# EasyEDA Pro project ProPrj_ETHlink8DAC_V1.0.epro, board ETHlink8xDAC_PCB
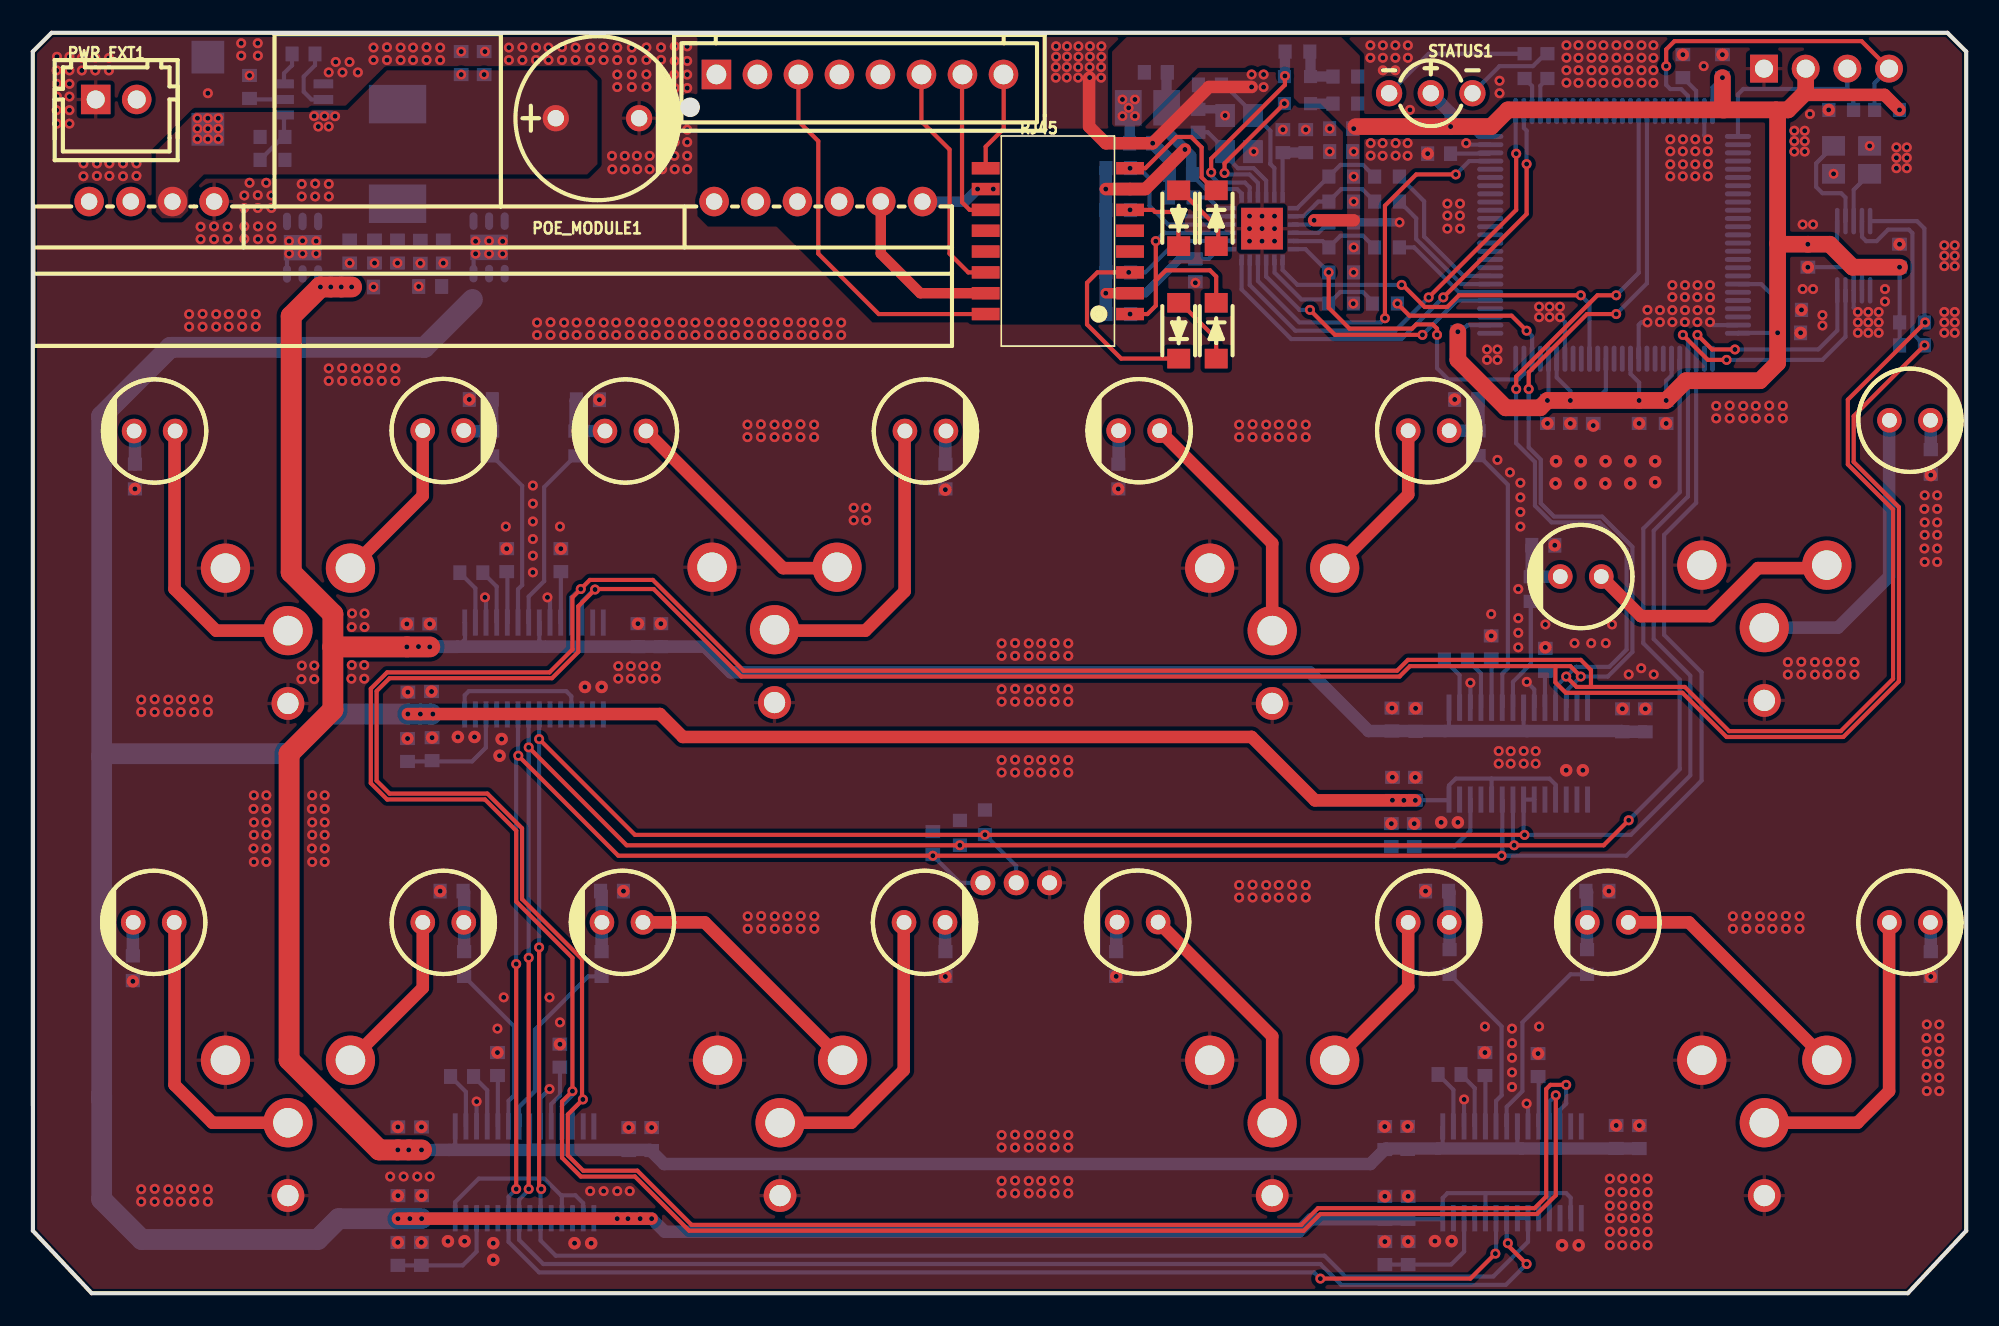
[diagram p8: board, top side]
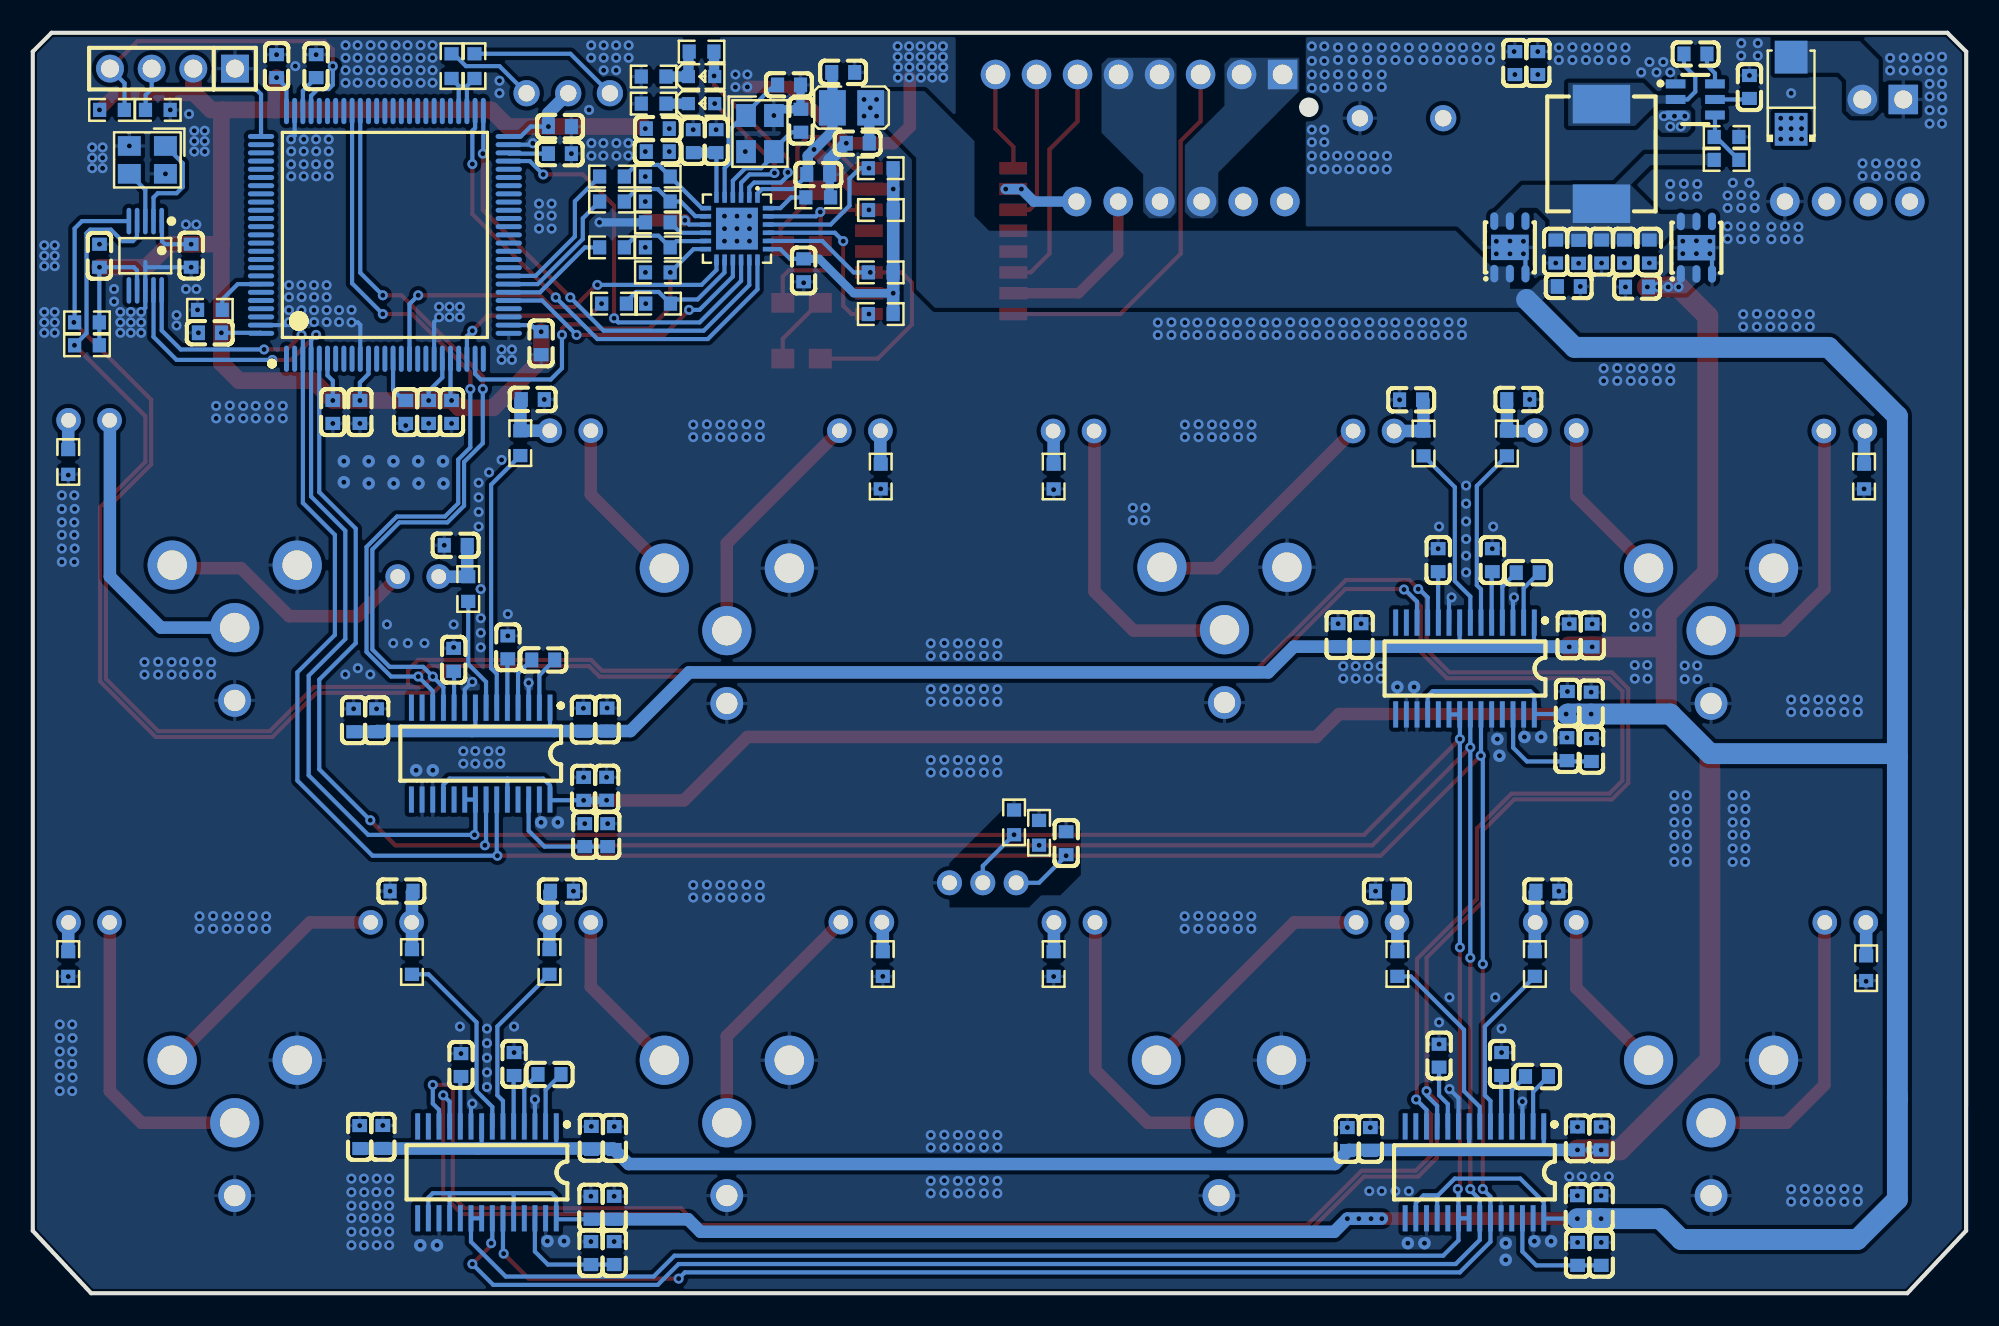
[diagram p9: board, bottom side, seen from below]

Outline 117.86 x 76.84 mm; copper layers: Top Layer, Bottom Layer. Coordinates in mm from the lower left corner of the outline.
Outline path: 0,75.69 1.15,76.84 116.72,76.84 117.86,75.69 117.86,3.8 114.3,0 3.59,0 0,3.81 0,75.69
Stack: Top Layer 0.035mm / Dielectric1 1.51mm FR4 er 4.5 / Bottom Layer 0.035mm

## Design rules (mm)
template: JLCPCB Capability(Two Layers Board)
spacing copperThickness1oz (default): track to track 0.102, other pairs 0.152 to 0.3
spacing copperThickness2oz: track to track 0.203, other pairs 0.152 to 0.3
track width copperThickness1oz (default): min 0.127, default 0.254, max 2.54
track width copperThickness2oz: min 0.203, default 0.254, max 2.54
differential pair differentialPair (default): width min 0.127, default 0.254, max 2.54; gap min 0.152, default 0.152
via viaSize (default): diameter min 0.5, default 0.61, max 10; hole min 0.3, default 0.305, max 6.3

## Placement (name value [footprint] x y rotation side)
C116  10uF  [C0603]  38.29 40.11 270 bottom
C117  100nF  [C0603]  36.89 40.11 270 bottom
C118  860020773013  [CAP-TH_BD6.3-P2.50-D0.5-FD]  7.43 52.56 180 top
C119  10uF  [C0603]  82.85 34.97 270 bottom
C120  860020773013  [CAP-TH_BD6.3-P2.50-D0.5-FD]  25.02 52.59 0 top
C121  860020773013  [CAP-TH_BD6.3-P2.50-D0.5-FD]  36.13 52.56 180 top
C122  2.2nF  [C0603]  33.84 54.47 0 bottom
C123  860020773013  [CAP-TH_BD6.3-P2.50-D0.5-FD]  54.42 52.56 0 top
C124  100nF  [C0603]  84.3 34.95 270 bottom
C125  860020773013  [CAP-TH_BD6.3-P2.50-D0.5-FD]  114.43 53.21 0 top
C126  100nF  [C0603]  24.31 35.98 270 bottom
C127  10uF  [C0603]  22.86 35.94 270 bottom
C128  100nF  [C0603]  22.8 40.1 270 bottom
C129  10uF  [C0603]  24.2 40.1 270 bottom
C130  2.2uF  [C0603]  28.89 44.69 270 bottom
C131  860020773013  [CAP-TH_BD6.3-P2.50-D0.5-FD]  94.36 43.69 180 top
C132  2.2nF  [C0603]  27.31 54.48 0 bottom
C133  10uF  [C0603]  32.19 44.69 270 bottom
C134  2.2uF  [C0603]  26.73 43.92 0 bottom
C135  100nF  [C0603]  24.34 33.17 270 bottom
C136  10uF  [C0603]  22.84 33.11 270 bottom
C137  860020773013  [CAP-TH_BD6.3-P2.50-D0.5-FD]  85.09 52.58 0 top
C138  2.2nF  [C0603]  87.38 54.48 180 bottom
C139  860020773013  [CAP-TH_BD6.3-P2.50-D0.5-FD]  67.44 52.58 180 top
C140  100nF  [C0603]  84.28 30.74 270 bottom
C141  10uF  [C0603]  82.88 30.75 270 bottom
C142  100nF  [C0603]  98.3 34.93 270 bottom
C143  10uF  [C0603]  96.91 34.93 270 bottom
C144  2.2uF  [C0603]  88.9 39.37 270 bottom
C145  2.2nF  [C0603]  92.08 45.59 180 bottom
C146  10uF  [C0603]  92.21 38.61 270 bottom
C147  2.2uF  [C0603]  86.75 38.61 0 bottom
C148  100nF  [C0603]  84.21 27.92 270 bottom
C149  10uF  [C0603]  82.82 27.92 270 bottom
C150  10uF  [C0603]  22.25 9.44 270 bottom
C151  100nF  [C0603]  23.7 9.44 270 bottom
C152  860020773013  [CAP-TH_BD6.3-P2.50-D0.5-FD]  54.36 22.61 0 top
C153  860020773013  [CAP-TH_BD6.3-P2.50-D0.5-FD]  35.95 22.61 180 top
C154  860020773013  [CAP-TH_BD6.3-P2.50-D0.5-FD]  25.02 22.61 0 top
C155  2.2nF  [C0603]  25.53 24.51 180 bottom
C156  860020773013  [CAP-TH_BD6.3-P2.50-D0.5-FD]  7.37 22.61 180 top
C157  100nF  [C0603]  23.7 5.24 270 bottom
C158  10uF  [C0603]  22.26 5.24 270 bottom
C159  100nF  [C0603]  36.33 9.4 270 bottom
C160  10uF  [C0603]  37.72 9.4 270 bottom
C161  2.2uF  [C0603]  28.33 13.97 270 bottom
C162  2.2nF  [C0603]  35.31 24.51 180 bottom
C163  10uF  [C0603]  32.14 14.48 270 bottom
C164  2.2uF  [C0603]  26.17 13.21 0 bottom
C165  100nF  [C0603]  23.69 2.4 270 bottom
C166  10uF  [C0603]  22.25 2.4 270 bottom
C167  10uF  [C0603]  83.81 9.47 270 bottom
C168  100nF  [C0603]  82.41 9.46 270 bottom
C169  860020773013  [CAP-TH_BD6.3-P2.50-D0.5-FD]  114.43 22.61 0 top
C170  860020773013  [CAP-TH_BD6.3-P2.50-D0.5-FD]  96.02 22.61 180 top
C171  860020773013  [CAP-TH_BD6.3-P2.50-D0.5-FD]  85.09 22.61 0 top
C172  2.2nF  [C0603]  85.6 24.51 180 bottom
C173  860020773013  [CAP-TH_BD6.3-P2.50-D0.5-FD]  67.35 22.62 180 top
C174  100nF  [C0603]  82.42 5.21 270 bottom
C175  10uF  [C0603]  83.84 5.21 270 bottom
C176  100nF  [C0603]  96.52 9.53 270 bottom
C177  10uF  [C0603]  97.93 9.52 270 bottom
C178  2.2uF  [C0603]  88.52 13.97 270 bottom
C179  2.2nF  [C0603]  95.38 24.51 180 bottom
C180  10uF  [C0603]  91.76 13.91 270 bottom
C181  2.2uF  [C0603]  86.36 13.34 0 bottom
C182  100nF  [C0603]  83.84 2.45 270 bottom
C183  10uF  [C0603]  82.42 2.45 270 bottom
C184  10uF  [C0603]  113.8 63.25 90 bottom
C185  10uF  [C0603]  108.21 63.25 270 bottom
C192  100nF  [C0603]  26.12 74.99 270 bottom
C193  100nF  [C0603]  16.5 75.55 0 bottom
C194  10uF  [C0603]  25.02 63.5 90 bottom
C195  10uF  [C0603]  20.83 63.5 90 bottom
C196  10uF  [C0603]  22.23 63.5 90 bottom
C197  10uF  [C0603]  19.32 63.5 90 bottom
C198  1000uF  [CAP-TH_BD10.0-P5.00-D1.0-FD]  34.42 71.63 0 top
C201  100nF  [C0603]  13.21 73.53 90 bottom
C202  10uF  [C0603]  24.22 61.37 180 bottom
C203  10uF  [C0603]  23.63 63.48 270 bottom
C204  10uF  [C0603]  20.07 61.34 0 bottom
C210  1uF  [C0603]  27.51 74.99 270 bottom
C214  100nF  [C0603]  70.87 62.36 90 bottom
C215  10uF  [C0603]  68.46 74.42 180 bottom
C216  1uF  [C0603]  77.6 70.23 270 bottom
C217  100nF  [C0603]  69.98 68.2 0 bottom
C218  10uF  [C0603]  67.57 70.1 180 bottom
C219  10pF  [C0603]  71.04 71.47 270 bottom
C220  470pF  [C0603]  76.2 70.23 270 bottom
C221  10pF  [C0603]  71.76 73.66 180 bottom
C223  100nF  [C0603]  79.76 70.99 0 bottom
C224  10uF  [C0603]  79.76 69.6 180 bottom
C225  100nF  [C0603]  103 74.8 270 bottom
C228  2.2uF  [C0603]  85.73 69.47 180 bottom
C229  2.2uF  [C0603]  100.59 74.8 90 bottom
C230  100nF  [C0603]  97.92 53.72 90 bottom
C231  100nF  [C0603]  99.57 53.72 90 bottom
C232  100nF  [C0603]  85.73 71.12 0 bottom
C233  100nF  [C0603]  92.33 53.72 90 bottom
C234  100nF  [C0603]  107.07 58.55 180 bottom
C235  100nF  [C0603]  93.73 53.72 90 bottom
C236  100nF  [C0603]  86.87 57.91 90 bottom
C237  100nF  [C0603]  95.13 53.72 90 bottom
C238  2.2nF  [C0603]  54.87 27.43 270 bottom
D3  SS34  [SMA_L4.3-W2.6-LS5.2-RD]  10.67 73.15 90 bottom
L1  4.7uH  [IND-SMD_L7.0-W6.6_0630CDMCCDS]  22.24 69.45 270 bottom
L3  PT61017PEL  [XFMR-SMD_PT61017PEL]  62.49 64.14 90 top
L4  1uH  [L1008]  67.95 72.26 180 bottom
LED1  MHT192JGCT  [LED0603-RD]  77.09 74.17 180 bottom
LED2  MHT192JGCT  [LED0603-RD]  77.09 72.52 180 bottom
NOREF  -  [Pad_e13384]  57.92 25.02 0 top
NOREF#2  -  [Pad_e13387]  61.98 25.02 0 top
NOREF#3  -  [Pad_e13382]  59.95 25.02 0 top
NOREF#4  -  [Pad_e618]  74.93 64.9 0 top
POE_MODULE1  DP9700 at-12V2A  [PWRM-TH_DP9700-XX]  28.83 66.55 180 top
PWR_EXT1  ZX-XH2.54-2PZZ  [CONN-TH_2P-P2.50_HX25003-2A]  5.08 72.77 0 top
R100  470Ω  [R0603]  91.32 42.93 90 bottom
R101  470Ω  [R0603]  28 51.8 90 bottom
R102  470Ω  [R0603]  33.08 51.8 90 bottom
R103  4.7kΩ  [R0603]  55.63 49.78 90 bottom
R104  4.7kΩ  [R0603]  6.23 49.78 90 bottom
R105  470Ω  [R0603]  88.14 51.82 90 bottom
R106  4.7kΩ  [R0603]  66.17 49.78 90 bottom
R107  4.7kΩ  [R0603]  115.7 50.67 90 bottom
R108  470Ω  [R0603]  34.68 20.07 90 bottom
R109  470Ω  [R0603]  26.29 20.07 90 bottom
R110  4.7kΩ  [R0603]  6.1 19.81 90 bottom
R111  4.7kΩ  [R0603]  55.63 20.07 90 bottom
R112  470Ω  [R0603]  94.75 20.19 90 bottom
R113  470Ω  [R0603]  86.36 20.19 90 bottom
R114  4.7kΩ  [R0603]  66.04 20.07 90 bottom
R115  4.7kΩ  [R0603]  115.7 20.07 90 bottom
R118  4.7kΩ  [R0603]  114.56 59.18 180 bottom
R119  4.7kΩ  [R0603]  114.56 57.79 180 bottom
R123  10kΩ  [R0603]  14.61 70.49 180 bottom
R124  33kΩ  [R0603]  14.61 69.09 0 bottom
R127  47Ω  [R0603]  66.17 62.23 180 bottom
R128  47Ω  [R0603]  66.17 59.69 180 bottom
R129  47Ω  [R0603]  66.17 68.58 180 bottom
R130  47Ω  [R0603]  66.16 66.03 180 bottom
R131  12.1kΩ  [R0603]  69.98 66.8 180 bottom
R132  47Ω  [R0603]  82.55 66.55 0 bottom
R133  47Ω  [R0603]  82.55 68.07 0 bottom
R134  4.7kΩ  [R0603]  79.76 65.28 0 bottom
R135  1.5kΩ  [R0603]  79.76 62.23 0 bottom
R136  4.7kΩ  [R0603]  79.76 68.07 0 bottom
R137  4.7kΩ  [R0603]  79.76 66.55 0 bottom
R138  4.7kΩ  [R0603]  79.74 60.33 0 bottom
R139  47Ω  [R0603]  82.43 60.33 180 bottom
R140  4.7kΩ  [R0603]  79.76 63.75 0 bottom
R141  47Ω  [R0603]  82.55 63.75 180 bottom
R142  470Ω  [R0603]  80.01 74.17 0 bottom
R143  470Ω  [R0603]  80.01 72.52 0 bottom
R144  10kΩ  [R0603]  77.09 75.69 0 bottom
R145  10kΩ  [R0603]  107.07 59.94 0 bottom
R146  10kΩ  [R0603]  110.24 72.14 180 bottom
R147  10kΩ  [R0603]  113.03 72.14 0 bottom
R148  470Ω  [R0603]  92.33 74.8 270 bottom
R149  470Ω  [R0603]  90.94 74.8 270 bottom
R150  470Ω  [R0603]  56.52 28.07 90 bottom
R151  470Ω  [R0603]  58.04 28.7 90 bottom
RJ45  B8B-XH-AM  [CONN-TH_8P-P2.50_B8B-XH-AM-LF-SN]  50.42 74.3 0 top
STATUS1  209UYSYGW/S530-A3/R2  [LED-TH_3P-BD4.0-P2.54]  85.22 73.15 0 top
SW1  HB-PH3-25414PB2GOP  [HDR-TH_4P-P2.54-V-M]  109.35 74.65 0 bottom
U12  PCM5122PW  [TSSOP-28_L9.8-W6.6-P0.65-BL]  30.55 38.08 0 bottom
U13  PCM5122PW  [TSSOP-28_L9.8-W6.6-P0.65-BL]  90.55 32.89 0 bottom
U14  PCM5122PW  [TSSOP-28_L9.8-W6.6-P0.65-BL]  29.98 7.37 0 bottom
U15  PCM5122PW  [TSSOP-28_L9.8-W6.6-P0.65-BL]  90.17 7.37 0 bottom
U16  SI5351A-B-GTR  [MSOP-10_L3.0-W3.0-P0.50-LS5.0-BL]  111 63.25 0 bottom
U17  STM32H743VIT6  [LQFP-100_L14.0-W14.0-P0.50-LS16.0-BL]  96.4 64.52 180 bottom
U18  AP62300WU-7  [TSOT-23-6_L2.9-W1.6-P0.95-LS2.8-BL]  16.51 72.77 270 bottom
U19  LD39200PUR  [DFN-6_L3.0-W3.0-P0.95-BL-EP-1]  27.82 63.75 180 bottom
U20  LD39200PUR  [DFN-6_L3.0-W3.0-P0.95-BL-EP-1]  16.45 63.74 180 bottom
U22  LAN8742A-CZ  [QFN-24_L4.0-W4.0-P0.50-BL-EP2.6]  74.93 64.9 0 bottom
U23  MMSZ5228B  [SOD-123_L2.8-W1.8-LS3.9-FD]  72.14 65.53 90 top
U24  MMSZ5228B  [SOD-123_L2.8-W1.8-LS3.9-FD]  69.85 58.67 270 top
U25  MMSZ5228B  [SOD-123_L2.8-W1.8-LS3.9-FD]  72.14 58.67 90 top
U26  MMSZ5228B  [SOD-123_L2.8-W1.8-LS3.9-FD]  69.85 65.53 270 top
X1  25MHz  [CRYSTAL-SMD_4P-L3.2-W2.5-BL]  110.88 69.09 0 bottom
X2  25MHz  [CRYSTAL-SMD_4P-L3.2-W2.5-BL]  73.53 70.69 270 bottom
XLR9  NC3MAAV  [CONN-TH_NC3MAAV]  15.55 40.08 0 top
XLR10  NC3MAAV  [CONN-TH_NC3MAAV]  45.22 40.13 0 top
XLR11  NC3MAAV  [CONN-TH_NC3MAAV]  75.55 40.08 0 top
XLR12  NC3MAAV  [CONN-TH_NC3MAAV]  105.55 40.26 0 top
XLR13  NC3MAAV  [CONN-TH_NC3MAAV]  15.55 10.08 0 top
XLR14  NC3MAAV  [CONN-TH_NC3MAAV]  45.55 10.08 0 top
XLR15  NC3MAAV  [CONN-TH_NC3MAAV]  75.55 10.08 0 top
XLR16  NC3MAAV  [CONN-TH_NC3MAAV]  105.55 10.08 0 top

## Footprints (pads in the part's own frame, mm; a bottom-side part is the same pattern mirrored in y, then rotated)
C0603
  rect 0.8x0.9 smd: 1(-0.7,0) 2(0.7,0)
CAP-TH_BD6.3-P2.50-D0.5-FD
  round 1.5 hole 0.9: 1(-1.25,0) 2(1.25,0)
CAP-TH_BD10.0-P5.00-D1.0-FD
  round 1.6 hole 1: 1(-2.54,0) 2(2.54,0)
CONN-TH_2P-P2.50_HX25003-2A
  rect 1.8x1.8 hole 1.1: 1(-1.25,0)
  round 1.8 hole 1.1: 2(1.25,0)
CONN-TH_8P-P2.50_B8B-XH-AM-LF-SN
  rect 1.8x1.8 hole 1.2: 1(-8.75,0)
  round 1.8 hole 1.2: 2(-6.25,0) 3(-3.75,0) 4(-1.25,0) 5(1.25,0) 6(3.75,0) 7(6.25,0) 8(8.75,0)
CONN-TH_NC3MAAV
  round 3 hole 1.8: 1(-3.81,4.125) 2(3.81,4.125) 3(0,0.315)
  round 2 hole 1.3: 4(0,-4.125)
CRYSTAL-SMD_4P-L3.2-W2.5-BL
  rect 1.4x1.2 smd: 1(-1.1,-0.85) 2(1.1,-0.85) 3(1.1,0.85) 4(-1.1,0.85)
DFN-6_L3.0-W3.0-P0.95-BL-EP-1
  oval 0.49x1.07 smd: 1(-0.95,-1.6) 2(0,-1.6) 3(0.95,-1.6) 4(0.95,1.6) 5(0,1.6) 6(-0.95,1.6)
  rect 2.3x1.55 smd: 7(0,0)
HDR-TH_4P-P2.54-V-M
  rect 1.7x1.7 hole 1.1: 1(-3.81,0)
  round 1.7 hole 1.1: 2(-1.27,0) 3(1.27,0) 4(3.81,0)
IND-SMD_L7.0-W6.6_0630CDMCCDS
  rect 2.35x3.5 smd: 1(-3.035,0) 2(3.035,0)
L1008
  rect 1.635x2.16 smd: 1(-1.167,0) 2(1.167,0)
LED0603-RD
  rect 0.8x0.8 smd: 1(-0.799,0) 2(0.799,0)
LED-TH_3P-BD4.0-P2.54
  round 1.6 hole 1: 1(-2.54,0) 2(0,0) 3(2.54,0)
LQFP-100_L14.0-W14.0-P0.50-LS16.0-BL
  oval 0.3x1.6 smd: 1(-6,-7.55) 2(-5.5,-7.55) 3(-5,-7.55) 4(-4.5,-7.55) 5(-4,-7.55) 6(-3.5,-7.55) 7(-3,-7.55) 8(-2.5,-7.55) 9(-2,-7.55) 10(-1.5,-7.55) 11(-1,-7.55) 12(-0.5,-7.55) 13(0,-7.55) 14(0.5,-7.55) 15(1,-7.55) 16(1.5,-7.55) 17(2,-7.55) 18(2.5,-7.55) 19(3,-7.55) 20(3.5,-7.55) 21(4,-7.55) 22(4.5,-7.55) 23(5,-7.55) 24(5.5,-7.55) 25(6,-7.55) 51(6,7.55) 52(5.5,7.55) 53(5,7.55) 54(4.5,7.55) 55(4,7.55) 56(3.5,7.55) 57(3,7.55) 58(2.5,7.55) 59(2,7.55) 60(1.5,7.55) 61(1,7.55) 62(0.5,7.55) 63(0,7.55) 64(-0.5,7.55) 65(-1,7.55) 66(-1.5,7.55) 67(-2,7.55) 68(-2.5,7.55) 69(-3,7.55) 70(-3.5,7.55) 71(-4,7.55) 72(-4.5,7.55) 73(-5,7.55) 74(-5.5,7.55) 75(-6,7.55)
  oval 1.6x0.3 smd: 26(7.55,-6) 27(7.55,-5.5) 28(7.55,-5) 29(7.55,-4.5) 30(7.55,-4) 31(7.55,-3.5) 32(7.55,-3) 33(7.55,-2.5) 34(7.55,-2) 35(7.55,-1.5) 36(7.55,-1) 37(7.55,-0.5) 38(7.55,0) 39(7.55,0.5) 40(7.55,1) 41(7.55,1.5) 42(7.55,2) 43(7.55,2.5) 44(7.55,3) 45(7.55,3.5) 46(7.55,4) 47(7.55,4.5) 48(7.55,5) 49(7.55,5.5) 50(7.55,6) 76(-7.55,6) 77(-7.55,5.5) 78(-7.55,5) 79(-7.55,4.5) 80(-7.55,4) 81(-7.55,3.5) 82(-7.55,3) 83(-7.55,2.5) 84(-7.55,2) 85(-7.55,1.5) 86(-7.55,1) 87(-7.55,0.5) 88(-7.55,0) 89(-7.55,-0.5) 90(-7.55,-1) 91(-7.55,-1.5) 92(-7.55,-2) 93(-7.55,-2.5) 94(-7.55,-3) 95(-7.55,-3.5) 96(-7.55,-4) 97(-7.55,-4.5) 98(-7.55,-5) 99(-7.55,-5.5) 100(-7.55,-6)
MSOP-10_L3.0-W3.0-P0.50-LS5.0-BL
  oval 0.28x1.62 smd: 1(-1,-2.11) 2(-0.5,-2.11) 3(0,-2.11) 4(0.5,-2.11) 5(1,-2.11) 6(1,2.11) 7(0.5,2.11) 8(0,2.11) 9(-0.5,2.11) 10(-1,2.11)
Pad_e618
  rect 2.54x2.54 smd: 101(0,0)
Pad_e13382
  round 1.524 hole 0.914: 1(0,0)
Pad_e13384
  round 1.524 hole 0.914: 2(0,0)
Pad_e13387
  round 1.524 hole 0.914: 3(0,0)
PWRM-TH_DP9700-XX
  round 1.8 hole 1: 1(-25.4,0) 2(-22.86,0) 3(-20.32,0) 4(-17.78,0) 5(-15.24,0) 6(-12.7,0) 7(17.78,0) 8(20.32,0) 9(22.86,0) 10(25.4,0)
QFN-24_L4.0-W4.0-P0.50-BL-EP2.6
  rect 0.28x0.665 smd: 1(-1.25,-1.907) 2(-0.75,-1.907) 3(-0.25,-1.907) 4(0.25,-1.907) 5(0.75,-1.907) 6(1.25,-1.907) 13(1.25,1.907) 14(0.75,1.907) 15(0.25,1.907) 16(-0.25,1.907) 17(-0.75,1.907) 18(-1.25,1.907)
  rect 0.665x0.28 smd: 7(1.907,-1.25) 8(1.907,-0.75) 9(1.907,-0.25) 10(1.907,0.25) 11(1.907,0.75) 12(1.907,1.25) 19(-1.907,1.25) 20(-1.907,0.75) 21(-1.907,0.25) 22(-1.907,-0.25) 23(-1.907,-0.75) 24(-1.907,-1.25)
  rect 2.55x2.55 smd: 25(0,0)
R0603
  rect 0.806x0.864 smd: 1(-0.753,0) 2(0.753,0)
SMA_L4.3-W2.6-LS5.2-RD
  rect 2x2 smd: 1(-2.2,0) 2(2.2,0)
SOD-123_L2.8-W1.8-LS3.9-FD
  rect 1.2x1.4 smd: 1(-1.7,0) 2(1.7,0)
TSOT-23-6_L2.9-W1.6-P0.95-LS2.8-BL
  rect 0.55x1.2 smd: 1(-0.95,-1.2) 2(0,-1.2) 3(0.95,-1.2) 4(0.95,1.2) 5(0,1.2) 6(-0.95,1.2)
TSSOP-28_L9.8-W6.6-P0.65-BL
  rect 0.3x1.6 smd: 1(-4.225,-2.8) 2(-3.575,-2.8) 3(-2.925,-2.8) 4(-2.275,-2.8) 5(-1.625,-2.8) 6(-0.975,-2.8) 7(-0.325,-2.8) 8(0.325,-2.8) 9(0.975,-2.8) 10(1.625,-2.8) 11(2.275,-2.8) 12(2.925,-2.8) 13(3.575,-2.8) 14(4.225,-2.8) 15(4.225,2.8) 16(3.575,2.8) 17(2.925,2.8) 18(2.275,2.8) 19(1.625,2.8) 20(0.975,2.8) 21(0.325,2.8) 22(-0.325,2.8) 23(-0.975,2.8) 24(-1.625,2.8) 25(-2.275,2.8) 26(-2.925,2.8) 27(-3.575,2.8) 28(-4.225,2.8)
XFMR-SMD_PT61017PEL
  rect 0.76x1.7 smd: 1(-4.445,-4.4) 2(-3.175,-4.4) 3(-1.905,-4.4) 4(-0.635,-4.4) 5(0.635,-4.4) 6(1.905,-4.4) 7(3.175,-4.4) 8(4.445,-4.4) 9(4.445,4.4) 10(3.175,4.4) 11(1.905,4.4) 12(0.635,4.4) 13(-0.635,4.4) 14(-1.905,4.4) 15(-3.175,4.4) 16(-4.445,4.4)

## Nets
As in the schematic, except:
GND: C116.1 C117.1 C119.1 C122.2 C124.1 C126.1 C127.1 C128.1 C129.1 C130.1 C132.1 C133.1 C135.1 C136.1 C138.2 C140.1 C141.1 C142.1 C143.1 C144.1 C145.1 C146.1 C148.1 C149.1 C150.1 C151.1 C155.2 C157.1 C158.1 C159.1 C160.1 C161.1 C162.1 C163.1 C165.1 C166.1 C167.1 C168.1 C172.2 C174.1 C175.1 C176.1 C177.1 C178.1 C179.1 C180.1 C182.1 C183.1 C184.2 C185.2 C192.1 C194.1 C195.1 C196.1 C197.1 C198.2 C201.2 C202.2 C203.2 C204.2 C210.1 C214.1 C215.2 C216.1 C217.1 C218.1 C219.1 C220.1 C221.2 C223.1 C224.2 C225.1 C228.2 C229.2 C230.1 C231.1 C232.1 C233.1 C234.1 C235.1 C236.1 C237.1 C238.1 NOREF#2.3 NOREF#4.101 POE_MODULE1.7 PWR_EXT1.1 R103.1 R104.1 R106.1 R107.1 R110.1 R111.1 R114.1 R115.1 R123.2 R131.2 R134.2 R142.2 R143.2 R145.2 R146.2 R150.2 R151.2 SW1.1 U12.3 U12.9 U12.16 U12.17 U12.24 U12.27 U13.3 U13.9 U13.16 U13.17 U13.27 U14.3 U14.9 U14.17 U14.24 U14.27 U15.3 U15.9 U15.17 U15.27 U16.8 U17.10 U17.19 U17.26 U17.49 U17.74 U17.99 U18.1 U19.3 U19.7 U20.3 U20.7 U22.25 X1.2 X1.4 X2.2 X2.4 XLR9.1 XLR9.4 XLR10.1 XLR10.4 XLR11.1 XLR11.4 XLR12.1 XLR12.4 XLR13.1 XLR13.4 XLR14.1 XLR14.4 XLR15.1 XLR15.4 XLR16.1 XLR16.4
BCK: NOREF#3.1 R151.1 U12.20 U12.21 U13.20 U13.21 U14.20 U14.21 U15.20 U15.21 U16.9 U17.4
FS: C238.2 NOREF.2 U12.23 U13.23 U14.23 U15.23 U16.10 U17.3
SCLS: R119.1 U12.12 U13.12 U14.12 U15.12 U16.4 U17.67
SDAS: R118.1 U12.11 U13.11 U14.11 U15.11 U16.5 U17.66

Pads without a net: L3 4 5 12 13; POE_MODULE1 5 6 9 10; U12 13 14 15 19 25; U13 13 14 15 19 25; U14 13 14 15 19 25; U15 13 14 15 19 25; U16 6; U17 1 2 7 8 9 12 13 15 17 18 22 25 28 29 34 35 36 39 40 41 42 43 44 45 46 55 56 57 58 59 60 61 62 63 64 65 68 69 70 71 77 78 79 80 81 82 83 84 85 86 87 88 89 90 91 92 93 95 96 97 98; U19 4; U20 4

## Via types
v1: diameter 0.61, hole 0.305, Top Layer to Bottom Layer, 877 vias
v2: diameter 0.762, hole 0.305, Top Layer to Bottom Layer, 100 vias

## Routing (per net, layer and track width the routed paths; a pad name or vN(x,y) marks a point on that pad's centre or on a via; arc(x,y) is an arc through that point)
12V:
  vias: v1(10.04,71.63) v1(10.04,70.99) v1(10.04,70.36) v1(10.67,71.63) v1(10.67,70.99) v1(10.67,70.36) v1(11.31,71.63) v1(11.31,70.99) v1(11.31,70.36) v1(17.15,71.76) v1(17.4,71.12) v1(17.78,71.76) v1(18.04,71.12) v1(18.43,71.75) v1(26.12,74.29) v1(27.51,74.29)
A3V3: length 246.7
  Top Layer w1.27: v1(19.44,61.34) v1(18.8,61.34) v1(18.17,61.34) v1(17.53,61.34) 15.75,59.56 15.75,43.94 18.29,41.4 18.29,39.4 ; v1(23.7,8.74) v1(22.92,8.74) v1(22.25,8.74) 21.11,8.74 15.62,14.22 15.62,32.89 18.29,35.56 18.29,39.4 ; 18.29,39.4 v1(22.8,39.4) v1(24.2,39.4)
  Bottom Layer w0.254: 86.08,34.27 86.33,34.52 U13.1 ; 25.38,8.74 25.75,9.11 U14.1 ; 91.09,34.27 90.88,34.48 U13.8 ; 90.5,10.17 90.5,9.07 90.75,8.82 ; 31.24,39.41 30.88,39.78 U12.8 ; U15.1 85.95,9.11 85.6,8.76 C168.2 ; U12.1 26.35,40.86 26.35,39.86 25.89,39.4 ; v1(22.8,39.4) v1(24.2,39.4) ; U14.8 30.3,9.09 30.29,9.08 30.68,8.7 C159.2 C160.2
  Bottom Layer w0.762: v1(24.2,39.4) 25.89,39.4 ; C177.2 82.48,8.82 81.54,7.87 38.48,7.87 37.62,8.74 v1(23.7,8.74) ; v1(22.8,39.4) 22.82,39.41 C117.2 C116.2 40.98,39.41 42.55,37.85 77.86,37.85 81.43,34.27 C119.2 96.86,34.27 C143.2 C142.2
  vias: v1(23.51,39.42)
D3V3: length 423.8
  Top Layer w0.762: v1(78.11,65.41) 80.52,65.41 ; v1(22.86,35.31) v1(23.63,35.31) v1(24.39,35.31) 38.23,35.31 39.63,33.91 74.3,33.91 78.16,30.04 v1(83.58,30.04) v1(84.28,30.04) ; 108.01,73.15 108.11,73.05 112.88,73.05 v1(113.8,72.14) ; v1(22.26,4.54) v1(22.99,4.54) v1(23.7,4.54) v1(35.62,4.54) v1(36.28,4.54) v1(37.02,4.54) v1(37.72,4.54)
  Top Layer w1.016: v1(113.8,62.55) 110.94,62.55 109.54,63.95 v1(108.21,63.95) 106.42,63.95 106.36,64 ; 106.26,72.14 107,72.14 108.08,73.21 SW1.2 ; 106.26,72.14 106.36,72.04 106.36,64 ; 106.26,72.14 103.13,72.14 ; 103,72.14 v1(103,74.1) ; 103,72.14 89.92,72.14 88.9,71.12 v1(86.43,71.12) 80.65,71.12 ; 103,72.14 103.13,72.14 ; 106.36,64 v1(106.36,58.55) 106.36,56.7 105.29,55.63 100.78,55.63 v1(99.57,54.42) v1(97.92,54.42) v1(93.73,54.42) v1(92.33,54.42) 91.89,53.98 89.79,53.98 86.87,56.9 v2(86.87,58.61) ; 103.06,72.2 103.13,72.14
  Bottom Layer w0.254: v1(22.86,35.31) C127.2 ; U17.6 99.9,55.95 99.57,55.63 v1(99.57,54.42) ; U17.20 92.9,55.82 93.73,54.99 93.73,54.29 ; v1(106.36,58.55) 103.98,58.55 U17.100 ; U22.9 77.85,65.15 v1(78.11,65.41) ; 88.93,31.37 92.46,31.37 92.83,31 U13.18 ; 88.93,31.37 U13.24 ; 88.93,31.37 86.75,31.37 86.33,30.95 U13.28 86.29,30.05 v1(82.88,30.05) ; 88.55,6.1 86.24,6.1 85.95,5.81 U15.28 85.89,4.51 C175.2 ; 88.55,6.1 92.47,6.1 ; 88.55,6.1 U15.24 ; U17.21 92.4,54.42 92.33,54.36 ; U15.16 93.75,5.82 93.48,6.1 92.47,6.1 ; v1(97.92,54.42) 97.92,55.52 97.4,56.04 U17.11 ; 92.47,6.1 92.45,6.08 U15.18 ; v1(108.21,63.95) 109.8,63.95 109.99,64.14 109.99,65.34 U16.1 ; 86.87,58.67 87.13,58.67 87.47,59.02 U17.27 ; U14.16 33.55,5.49 33.08,5.97 32.2,5.97 ; v1(24.39,35.31) 26.3,35.31 U12.28 26.33,36.45 26.58,36.7 32.52,36.7 32.83,36.39 U12.18 ; R119.2 R118.2 113.8,62.54 v1(113.8,62.55) 111.7,62.55 111.51,62.36 111.51,61.14 U16.7 ; U17.75 102.4,73.5 v1(103,74.1) ; U17.50 88.11,70.52 87.51,71.12 v1(86.43,71.12) ; 32.2,5.97 31.18,6.99 27.18,6.99 25.75,5.55 U14.28 25.73,4.54 v1(23.7,4.54) ; 32.2,5.97 32.25,5.92 U14.18
  Bottom Layer w0.635: C218.2 66.87,72.2 v1(66.81,72.26) L4.2
  Bottom Layer w0.762: STATUS1.2 86.43,71.94 v1(86.43,71.12) ; C175.2 C174.2 77.92,4.51 77.16,3.75 38.52,3.75 v1(37.72,4.54) v1(37.02,4.54) v1(36.28,4.54) v1(35.62,4.54)
  Bottom Layer w1.27: 4.2,11.81 4.2,32.72 ; 4.2,11.81 4.2,5.72 6.64,3.27 17.38,3.27 18.65,4.54 v1(22.26,4.54) v1(22.99,4.54) v1(23.7,4.54) ; 4.2,11.81 4.2,12.08 ; 4.2,32.72 4.2,53.47 8.39,57.66 23.88,57.66 26.8,60.58 ; 4.2,32.72 4.37,32.89 15.62,32.89 18.04,35.31 v1(22.86,35.31) v1(23.63,35.31) 24.28,35.31 C126.2
  vias: v1(66.42,72.77) v1(66.42,71.76) v1(67.19,72.77) v1(67.19,71.76) v1(80.52,70.99) v1(80.52,69.6) v1(80.52,68.07) v1(80.52,66.55) v1(80.52,63.75) v1(80.51,62.23) v1(80.5,60.33)
GND: length 59.2
  Top Layer w0.762: v1(74.3,73.53) 71.7,73.53 v1(68.27,70.1) 65.41,70.1 64.39,71.12 64.39,74.08 v1(64.43,74.11)
  Bottom Layer w0.254: U17.10 97.9,59.03 98.05,59.18 v1(98.43,59.18) ; v1(102.24,59.2) 102.43,59.02 U17.99 ; v1(91.06,11.56) 91.15,11.47 U15.9 ; v1(87.25,11.81) 87.25,11.81 U15.3 ; v1(31.5,12.45) 30.95,11.9 30.95,10.17 ; v1(31.37,42.42) 31.53,42.26 U12.9 ; 111,62.58 111,62.87 ; 111,62.58 110.97,62.55 v2(108.21,62.55) ; 111,62.58 U16.8 111,60.07 v1(111.26,59.82) ; U20.7 15.99,63.74 15.5,63.24 U20.3 ; v1(93.1,59.5) 93.4,59.2 U17.19 ; U19.7 27.06,63.75 26.87,63.57 U19.3 ; v1(27.06,11.68) 27.05,11.68 U14.3 ; U13.9 91.53,36.81 v1(91.07,37.27) ; U13.3 87.63,35.7 v1(87.63,37.21) ; U12.3 27.63,42.35 v1(27.56,42.42) ; U17.49 87.47,70.02 v1(87.38,70.1) ; v1(102.12,70.34) 101.9,70.56 U17.74
  Bottom Layer w0.508: C221.2 71.06,72.2 C219.1 72.3,72.17 v1(72.68,71.79) ; R131.2 69.28,66.86 69.28,68.2 ; v1(83.32,65.28) R134.2
  Bottom Layer w0.762: v1(68.27,70.1) 69.28,69.09 69.28,68.2
  vias: v1(1.45,74.54) v1(1.45,72.12) v1(1.47,75.37) v1(1.47,73.72) v1(1.47,72.95) v1(1.47,71.3) v1(2.23,75.37) v1(2.23,74.54) v1(2.23,73.72) v1(2.23,72.95) v1(2.23,72.12) v1(2.23,71.3) v1(2.99,75.3) v1(2.99,74.54) v1(3.09,68.87) v1(3.09,68.09) v1(3.81,75.32) v1(3.81,74.54) v1(3.91,68.87) v1(3.91,68.11) v1(4.64,75.3) v1(4.64,74.54) v1(4.67,68.87) v1(4.67,68.11) v1(5.5,68.87) v1(5.5,68.09) v1(6.32,68.87) v1(6.32,68.11) v1(6.61,36.19) v1(6.61,35.42) v1(6.61,6.34) v1(6.61,5.58) v1(7.43,36.21) v1(7.43,35.42) v1(7.43,6.36) v1(7.43,5.58) v1(8.26,36.19) v1(8.26,35.42) v1(8.26,6.34) v1(8.26,5.58) v1(9.02,36.19) v1(9.02,35.42) v1(9.02,6.34) v1(9.02,5.58) v1(9.53,59.68) v1(9.53,58.92) v1(9.84,36.21) v1(9.84,35.42) v1(9.84,6.36) v1(9.84,5.58) v1(10.23,65.01) v1(10.23,64.25) v1(10.35,59.7) v1(10.35,58.92) v1(10.67,73.15) v1(10.67,36.19) v1(10.67,35.42) v1(10.67,6.34) v1(10.67,5.58) v1(11.05,65.03) v1(11.05,64.25) v1(11.18,59.68) v1(11.18,58.92) v1(11.88,65.01) v1(11.88,64.25) v1(11.94,59.68) v1(11.94,58.92) v1(12.7,76.2) v1(12.7,75.44) v1(12.76,59.7) v1(12.76,58.92) v1(12.89,66.92) v1(12.89,66.16) v1(12.89,65.03) v1(12.89,64.27) v1(13.21,74.23) v1(13.21,67.69) v1(13.48,30.35) v1(13.46,29.52) v1(13.48,28.7) v1(13.48,27.94) v1(13.46,27.11) v1(13.48,26.29) v1(13.59,59.68) v1(13.59,58.92) v1(13.71,76.2) v1(13.72,75.44) v1(13.72,66.94) v1(13.72,66.16) v1(13.73,65.03) v1(13.73,64.25) v1(14.23,67.69) v1(14.24,30.35) v1(14.24,29.52) v1(14.24,28.7) v1(14.24,27.94) v1(14.24,27.11) v1(14.24,26.29) v1(14.55,66.92) v1(14.55,66.16) v1(14.55,65.03) v1(14.55,64.27) v1(15.62,64.14) v1(15.62,63.37) v1(16.39,67.62) v1(16.39,66.86) v1(16.45,64.16) v1(16.45,63.37) v1(16.4,38.26) v1(16.38,37.43) v1(17.03,30.35) v1(17.01,29.52) v1(17.03,28.7) v1(17.03,27.94) v1(17.01,27.11) v1(17.03,26.29) v1(17.21,67.64) v1(17.21,66.86) v1(17.16,38.26) v1(17.16,37.43) v1(17.28,64.14) v1(17.28,63.37) v1(17.79,30.35) v1(17.79,29.52) v1(17.79,28.7) v1(17.79,27.94) v1(17.79,27.11) v1(17.79,26.29) v1(18.04,74.42) v1(18.04,67.62) v1(18.04,66.86) v1(18.04,56.38) v1(18.04,55.62) v1(18.47,75.06) v1(18.88,74.42) v1(18.86,56.4) v1(18.86,55.62) v1(19.31,75.06) v1(19.32,62.8) v1(19.44,40.61) v1(19.44,38.29) v1(19.42,37.46) v1(19.46,41.44) v1(19.69,56.38) v1(19.69,55.62) v1(19.82,74.42) v1(20.22,41.44) v1(20.22,40.61) v1(20.2,38.29) v1(20.2,37.46) v1(20.45,56.38) v1(20.45,55.62) v1(20.77,75.94) v1(20.77,75.17) v1(20.83,62.8) v1(20.77,61.34) v1(21.27,56.4) v1(21.27,55.62) v1(21.59,75.96) v1(21.59,75.17) v1(21.78,7.11) v1(22.1,56.38) v1(22.1,55.62) v1(22.23,62.8) v1(22.42,75.94) v1(22.42,75.17) v1(22.61,7.11) v1(23.18,75.94) v1(23.18,75.17) v1(23.44,7.11) v1(23.52,61.37) v1(23.63,62.78) v1(24,75.96) v1(24,75.17) v1(24.2,7.11) v1(24.83,75.94) v1(24.83,75.17) v1(25.02,62.8) v1(26.12,75.69) v1(26.99,64.12) v1(26.99,63.36) v1(27.56,75.69) v1(27.81,64.15) v1(27.81,63.36) v1(28.33,16.13) v1(28.64,64.12) v1(28.64,63.36) v1(28.71,18.03) v1(28.83,46.74) v1(29.02,75.94) v1(29.02,75.17) v1(29.84,75.96) v1(29.84,75.17) v1(30.48,49.23) v1(30.48,48.13) v1(30.48,47.05) v1(30.48,45.97) v1(30.48,44.96) v1(30.48,43.94) v1(30.67,75.94) v1(30.67,75.17) v1(30.74,59.17) v1(30.74,58.41) v1(31.44,75.94) v1(31.44,75.17) v1(31.5,18.03) v1(31.56,59.19) v1(31.56,58.41) v1(32.14,46.74) v1(32.14,16.51) v1(32.26,75.96) v1(32.26,75.17) v1(32.39,59.17) v1(32.39,58.41) v1(33.09,75.94) v1(33.09,75.17) v1(33.15,59.17) v1(33.15,58.41) v1(33.98,75.94) v1(33.98,75.17) v1(33.97,59.19) v1(33.97,58.41) v1(33.98,6.22) v1(34.8,75.96) v1(34.8,75.17) v1(34.8,59.17) v1(34.8,58.41) v1(34.8,6.22) v1(35.31,69.33) v1(35.33,68.51) v1(35.63,75.94) v1(35.63,75.17) v1(35.63,74.29) v1(35.63,73.53) v1(35.56,59.17) v1(35.56,58.41) v1(35.63,6.22) v1(35.69,38.23) v1(35.69,37.47) v1(36.09,69.33) v1(36.09,68.51) v1(36.38,59.19) v1(36.38,58.41) v1(36.45,38.23) v1(36.45,37.47) v1(36.39,6.22) v1(36.52,75.94) v1(36.52,75.17) v1(36.52,74.29) v1(36.52,73.53) v1(36.82,69.34) v1(36.84,68.52) v1(37.22,59.17) v1(37.22,58.41) v1(37.22,38.23) v1(37.22,37.47) v1(37.41,75.95) v1(37.41,75.18) v1(37.41,74.3) v1(37.41,73.54) v1(37.61,69.34) v1(37.61,68.52) v1(37.98,59.17) v1(37.98,58.41) v1(37.98,38.23) v1(37.98,37.47) v1(38.29,75.95) v1(38.29,75.18) v1(38.29,74.3) v1(38.29,73.54) v1(38.35,69.34) v1(38.37,68.52) v1(38.8,59.19) v1(38.8,58.41) v1(39.13,76.01) v1(39.13,75.12) v1(39.11,74.29) v1(39.13,73.47) v1(39.13,70.93) v1(39.13,70.17) v1(39.11,69.34) v1(39.13,68.52) v1(39.63,59.17) v1(39.63,58.41) v1(39.89,76.01) v1(39.89,75.12) v1(39.89,74.29) v1(39.89,73.47) v1(39.89,70.93) v1(39.89,70.17) v1(39.89,69.34) v1(39.89,68.52) v1(40.39,59.17) v1(40.39,58.41) v1(41.21,59.19) v1(41.21,58.41) v1(42.04,59.17) v1(42.04,58.41) v1(42.8,59.17) v1(42.8,58.41) v1(43.62,59.19) v1(43.62,58.41) v1(43.57,52.95) v1(43.57,52.19) v1(43.58,22.98) v1(43.58,22.22) v1(44.45,59.17) v1(44.45,58.41) v1(44.39,52.97) v1(44.39,52.19) v1(44.4,23) v1(44.4,22.22) v1(45.22,59.17) v1(45.22,58.41) v1(45.22,52.95) v1(45.22,52.19) v1(45.23,22.98) v1(45.23,22.22) v1(46.04,59.19) v1(46.04,58.41) v1(45.98,52.95) v1(45.98,52.19) v1(45.99,22.98) v1(45.99,22.22) v1(46.8,52.97) v1(46.8,52.19) v1(46.81,23) v1(46.81,22.22) v1(46.87,59.17) v1(46.87,58.41) v1(47.63,59.17) v1(47.63,58.41) v1(47.63,52.95) v1(47.63,52.19) v1(47.64,22.98) v1(47.64,22.22) v1(48.45,59.19) v1(48.45,58.41) v1(49.28,59.17) v1(49.28,58.41) v1(50.04,47.88) v1(50.04,47.12) v1(50.8,47.88) v1(50.8,47.12) v1(59.06,39.61) v1(59.06,38.85) v1(59.06,36.82) v1(59.06,36.06) v1(59.06,32.5) v1(59.06,31.74) v1(59.06,9.64) v1(59.06,8.88) v1(59.06,6.85) v1(59.06,6.09) v1(59.88,39.63) v1(59.88,38.85) v1(59.88,36.84) v1(59.88,36.06) v1(59.88,32.52) v1(59.88,31.74) v1(59.88,9.66) v1(59.88,8.88) v1(59.88,6.87) v1(59.88,6.09) v1(60.71,39.61) v1(60.71,38.85) v1(60.71,36.82) v1(60.71,36.06) v1(60.71,32.5) v1(60.71,31.74) v1(60.71,9.64) v1(60.71,8.88) v1(60.71,6.85) v1(60.71,6.09) v1(61.47,39.61) v1(61.47,38.85) v1(61.47,36.82) v1(61.47,36.06) v1(61.47,32.5) v1(61.47,31.74) v1(61.47,9.64) v1(61.47,8.88) v1(61.47,6.85) v1(61.47,6.09) v1(62.29,39.63) v1(62.29,38.85) v1(62.29,36.84) v1(62.29,36.06) v1(62.29,32.52) v1(62.29,31.74) v1(62.29,9.66) v1(62.29,8.88) v1(62.29,6.87) v1(62.29,6.09) v1(62.38,76.01) v1(62.38,75.37) v1(62.36,74.74) v1(62.36,74.1) v1(63.04,76.01) v1(63.04,75.38) v1(63.03,74.74) v1(63.03,74.11) v1(63.12,39.61) v1(63.12,38.85) v1(63.12,36.82) v1(63.12,36.06) v1(63.12,32.5) v1(63.12,31.74) v1(63.12,9.64) v1(63.12,8.88) v1(63.12,6.85) v1(63.12,6.09) v1(63.74,76.01) v1(63.74,75.37) v1(63.73,74.74) v1(63.73,74.1) v1(64.44,76.01) v1(64.44,75.38) v1(64.43,74.74) v1(65.14,76.01) v1(65.14,75.37) v1(65.12,74.74) v1(65.12,74.1) v1(70.87,61.6) v1(73.54,52.95) v1(73.54,52.19) v1(73.54,24.88) v1(73.54,24.12) v1(74.17,65.66) v1(74.17,64.9) v1(74.17,64.14) v1(74.3,74.3) v1(74.43,69.6) v1(74.36,52.97) v1(74.36,52.19) v1(74.36,24.9) v1(74.36,24.12) v1(74.93,65.66) v1(74.93,64.9) v1(74.93,64.14) v1(75.03,74.3) v1(75.03,73.52) v1(75.19,52.95) v1(75.19,52.19) v1(75.19,24.88) v1(75.19,24.12) v1(75.7,65.66) v1(75.7,64.9) v1(75.7,64.14) v1(75.95,52.95) v1(75.95,52.19) v1(75.95,24.88) v1(75.95,24.12) v1(76.2,70.93) v1(76.77,52.97) v1(76.77,52.19) v1(76.77,24.9) v1(76.77,24.12) v1(77.6,70.93) v1(77.6,52.95) v1(77.6,52.19) v1(77.6,24.88) v1(77.6,24.12) v1(79.06,70.99) v1(79.06,69.6) v1(81.54,76.07) v1(81.54,75.31) v1(81.55,70.11) v1(81.55,69.35) v1(82.3,76.07) v1(82.3,75.31) v1(82.3,74.55) v1(82.28,70.11) v1(82.28,69.34) v1(83.06,76.07) v1(83.06,75.31) v1(83.06,74.55) v1(83.08,70.11) v1(83.08,69.35) v1(83.82,76.07) v1(83.82,75.31) v1(83.81,70.11) v1(83.81,69.34) v1(83.95,72.14) v1(86.23,66.42) v1(86.23,65.69) v1(86.23,64.9) v1(87,66.42) v1(86.99,65.69) v1(87,64.9) v1(88.52,16.26) v1(88.65,57.53) v1(88.65,56.9) v1(88.9,41.4) v1(89.29,57.53) v1(89.29,56.9) v1(89.29,50.8) v1(89.41,73.91) v1(89.41,73.15) v1(89.36,33.05) v1(89.36,32.28) v1(90.05,50.04) v1(90.09,33.04) v1(90.09,32.28) v1(90.17,16.13) v1(90.17,15.24) v1(90.17,14.35) v1(90.17,13.46) v1(90.17,12.57) v1(90.55,42.93) v1(90.55,41.15) v1(90.55,40.26) v1(90.55,39.37) v1(90.68,49.4) v1(90.68,48.51) v1(90.68,47.63) v1(90.68,46.74) v1(90.89,33.05) v1(90.89,32.28) v1(91.61,33.04) v1(91.61,32.28) v1(91.83,60.13) v1(91.83,59.5) v1(91.83,16.26) v1(92.21,40.77) v1(92.46,60.13) v1(92.46,59.5) v1(93.1,60.13) v1(93.49,76.08) v1(93.49,75.32) v1(93.49,74.55) v1(93.49,73.79) v1(93.98,39.62) v1(94.22,76.08) v1(94.22,75.31) v1(94.22,74.55) v1(94.22,73.78) v1(95.02,76.08) v1(95.02,75.32) v1(95.02,74.55) v1(95.02,73.79) v1(95,39.62) v1(95.75,76.08) v1(95.75,75.31) v1(95.75,74.55) v1(95.75,73.78) v1(95.89,39.62) v1(96.13,6.99) v1(96.13,6.16) v1(96.13,5.33) v1(96.13,4.57) v1(96.13,3.75) v1(96.13,2.92) v1(96.27,40.77) v1(96.54,76.08) v1(96.54,75.32) v1(96.54,74.55) v1(96.54,73.79) v1(96.89,6.99) v1(96.92,6.16) v1(96.89,5.33) v1(96.89,4.57) v1(96.92,3.75) v1(96.89,2.92) v1(97.27,76.08) v1(97.27,75.31) v1(97.27,74.55) v1(97.27,73.78) v1(97.29,37.72) v1(97.68,6.99) v1(97.66,6.15) v1(97.68,5.33) v1(97.68,4.57) v1(97.66,3.74) v1(97.68,2.92) v1(98.05,38.1) v1(98.06,76.08) v1(98.06,75.32) v1(98.06,74.55) v1(98.06,73.79) v1(98.43,59.94) v1(98.44,6.99) v1(98.44,6.15) v1(98.44,5.33) v1(98.44,4.57) v1(98.44,3.74) v1(98.44,2.92) v1(98.79,76.08) v1(98.79,75.31) v1(98.79,74.55) v1(98.79,73.78) v1(98.81,37.72) v1(99.19,59.93) v1(99.19,59.2) v1(99.82,70.34) v1(99.82,69.61) v1(99.82,68.82) v1(99.82,68.09) v1(99.95,61.45) v1(99.95,60.72) v1(99.95,59.93) v1(99.95,59.2) v1(100.59,70.34) v1(100.58,69.61) v1(100.59,68.82) v1(100.58,68.09) v1(100.72,61.45) v1(100.71,60.72) v1(100.72,59.93) v1(100.71,59.2) v1(101.35,70.34) v1(101.35,69.61) v1(101.35,68.82) v1(101.35,68.09) v1(101.48,61.45) v1(101.47,60.72) v1(101.48,59.93) v1(101.47,59.2) v1(101.86,74.8) v1(102.11,69.61) v1(102.12,68.82) v1(102.11,68.09) v1(102.24,61.45) v1(102.24,60.72) v1(102.24,59.93) v1(102.62,54.09) v1(102.62,53.33) v1(103.44,54.11) v1(103.44,53.33) v1(103.64,22.98) v1(103.64,22.22) v1(104.27,54.09) v1(104.27,53.33) v1(104.46,23) v1(104.46,22.22) v1(105.03,54.09) v1(105.03,53.33) v1(105.29,22.98) v1(105.29,22.22) v1(105.85,54.11) v1(105.85,53.33) v1(106.05,22.98) v1(106.05,22.22) v1(106.68,54.09) v1(106.68,53.33) v1(106.87,23) v1(106.87,22.22) v1(106.99,38.47) v1(106.99,37.71) v1(107.38,70.87) v1(107.38,70.23) v1(107.38,69.6) v1(107.7,22.98) v1(107.7,22.22) v1(107.81,38.49) v1(107.81,37.71) v1(107.89,65.15) v1(107.89,61.21) v1(108.02,70.87) v1(108.02,70.23) v1(108.02,69.6) v1(108.33,71.88) v1(108.53,65.15) v1(108.53,61.21) v1(108.64,38.47) v1(108.64,37.71) v1(109.1,59.63) v1(109.1,58.99) v1(109.4,38.47) v1(109.4,37.71) v1(109.77,68.24) v1(110.22,38.49) v1(110.22,37.71) v1(111.05,38.47) v1(111.05,37.71) v1(111.26,59.18) v1(111.26,58.55) v1(111.89,59.82) v1(111.89,59.18) v1(111.89,58.55) v1(111.98,69.94) v1(112.53,59.82) v1(112.53,59.18) v1(112.53,58.55) v1(112.91,61.21) v1(112.91,60.45) v1(113.61,69.85) v1(113.61,69.22) v1(113.61,68.58) v1(114.24,69.85) v1(114.24,69.22) v1(114.24,68.58) v1(115.33,48.64) v1(115.31,47.81) v1(115.33,46.99) v1(115.33,46.23) v1(115.31,45.4) v1(115.33,44.58) v1(115.44,15.55) v1(115.44,13.14) v1(115.46,16.38) v1(115.46,14.73) v1(115.46,13.97) v1(115.46,12.32) v1(116.09,48.64) v1(116.09,47.81) v1(116.09,46.99) v1(116.09,46.23) v1(116.09,45.4) v1(116.09,44.58) v1(116.22,16.38) v1(116.22,15.55) v1(116.22,14.73) v1(116.22,13.97) v1(116.22,13.14) v1(116.22,12.32) v1(116.53,63.88) v1(116.53,63.25) v1(116.53,62.61) v1(116.53,59.82) v1(116.53,59.18) v1(116.53,58.55) v1(117.16,63.88) v1(117.16,63.25) v1(117.16,62.61) v1(117.16,59.82) v1(117.16,59.18) v1(117.16,58.55) v2(6.1,19.01) v2(6.23,49.03) v2(22.25,10.14) v2(22.25,3.1) v2(22.26,5.94) v2(22.8,40.8) v2(22.84,33.81) v2(22.86,36.64) v2(23.7,10.14) v2(23.7,5.94) v2(23.69,3.1) v2(24.2,40.8) v2(24.31,36.68) v2(24.34,33.87) v2(24.83,24.51) v2(25.31,3.17) v2(25.91,33.91) v2(26.32,3.17) v2(26.61,54.48) v2(26.93,33.91) v2(28.07,3.05) v2(28.07,2.03) v2(28.33,14.67) v2(28.45,32.77) v2(28.58,33.78) v2(28.89,45.39) v2(32.14,15.18) v2(32.19,45.39) v2(33.02,3.05) v2(33.66,36.96) v2(34.04,3.05) v2(34.54,54.47) v2(34.68,36.96) v2(36.01,24.51) v2(36.33,10.1) v2(36.89,40.81) v2(37.72,10.1) v2(38.29,40.81) v2(55.63,48.98) v2(55.63,19.3) v2(66.04,19.31) v2(66.17,49.03) v2(82.41,10.16) v2(82.42,5.91) v2(82.42,3.15) v2(82.85,35.67) v2(82.82,28.62) v2(82.88,31.45) v2(83.81,10.17) v2(83.84,5.91) v2(83.84,3.15) v2(84.21,28.62) v2(84.3,35.65) v2(84.28,31.44) v2(84.9,24.51) v2(85.03,69.47) v2(85.48,3.18) v2(85.86,28.7) v2(86.49,3.18) v2(86.68,54.48) v2(86.87,28.7) v2(88.52,14.67) v2(88.9,40.07) v2(91.76,14.61) v2(92.21,39.37) v2(92.33,53.02) v2(92.83,49.36) v2(92.78,45.59) v2(92.85,50.72) v2(93.22,2.92) v2(93.48,31.88) v2(93.73,53.02) v2(94.24,2.92) v2(94.35,49.36) v2(94.37,50.72) v2(94.49,31.88) v2(95.13,52.89) v2(95.88,50.72) v2(95.86,49.36) v2(96.08,24.51) v2(96.52,10.22) v2(96.91,35.63) v2(97.39,50.72) v2(97.38,49.36) v2(97.92,53.02) v2(97.93,10.22) v2(98.3,35.63) v2(98.9,50.72) v2(98.9,49.44) v2(99.57,53.02) v2(100.59,75.5) v2(103,75.5) v2(107.82,59.94) v2(107.77,58.55) v2(109.48,72.14) v2(113.8,63.95) v2(115.7,49.87) v2(115.7,19.3)
BCK: length 220.9
  Top Layer w0.254: v1(30.87,21.08) 30.87,6.48 v1(30.99,6.35) ; v1(30.87,33.78) 36.71,27.94 v1(90.94,27.94) ; v1(103.26,56.9) 102.11,56.9 v1(100.59,58.42)
  Bottom Layer w0.254: NOREF#3.1 59.95,26.04 v1(58.04,27.95) ; 30.95,4.57 30.95,3.22 31.88,2.29 78.74,2.29 80.01,1.02 89.03,1.02 91.15,3.13 U15.20 90.5,4.57 ; 30.95,4.57 30.95,6.31 v1(30.99,6.35) ; 30.95,4.57 U14.21 ; v1(103.26,56.9) 109.1,56.9 110.5,58.3 U16.9 ; v1(100.59,58.42) 100.9,58.11 U17.4 100.9,48.57 98.81,46.48 98.81,39.88 101.04,37.65 101.04,31.57 97.41,27.94 v1(90.94,27.94) 90.88,28 U13.21 U13.20 ; U12.20 U12.21 30.87,35.27 v1(30.87,33.78) v1(30.87,21.08)
DAC_TDM: length 202.9
  Top Layer w0.254: v1(30.23,6.35) v1(30.23,20.45) ; v1(89.92,3.05) 89.92,2.92 v1(91.06,1.78) ; v1(97.29,28.83) 95.76,27.31 v1(90.3,27.31) v1(56.51,27.31) 36.2,27.31 v1(30.23,33.27)
  Bottom Layer w0.254: U17.5 100.4,48.83 98.17,46.61 98.17,39.62 100.4,37.4 100.4,31.94 v1(97.29,28.83) ; v1(30.23,20.45) v1(30.23,33.27) 30.23,35.28 U12.22 ; U13.22 90.23,27.38 v1(90.3,27.31) ; v1(91.06,1.78) 89.79,0.51 79.76,0.51 78.49,1.78 31.12,1.78 29.65,3.25 29.65,5.71 30.23,6.29 v1(30.23,6.35) ; v1(89.92,3.05) 89.85,3.12 U15.22
ETH_CRS_DV: length 6.7
  Bottom Layer w0.254: U17.31 86.94,61.02 84.2,63.75 R141.1
ETH_MDC: length 24.1
  Top Layer w0.254: v1(94.36,60.83) 86.94,60.83 86.23,60.12 84.85,60.12 83.51,61.47 v1(83.44,61.47)
  Bottom Layer w0.254: U17.16 94.9,60.3 v1(94.36,60.83) ; v1(83.44,61.47) 77.09,61.47 76.18,62.38 U22.13
ETH_MDIO: length 21.3
  Top Layer w0.254: v1(79,62.23) 79,60.07 80.27,58.8 84.08,58.8 84.33,59.06 85.35,59.06 85.6,58.8 v1(85.6,58.42)
  Bottom Layer w0.254: U22.12 77.58,63.65 v1(79,62.23) ; v1(85.6,58.42) 85.6,56.39 86.29,55.7 90.56,55.7 90.9,56.04 U17.24
ETH_REFCLK: length 10.4
  Top Layer w0.254: v1(91.06,58.67) 90.15,59.59 83.93,59.59 v1(83.19,60.33)
  Bottom Layer w0.254: v1(91.06,58.67) 91.4,58.34 U17.23
ETH_RST: length 17
  Top Layer w0.254: v1(77.86,59.94) 79.38,58.42 v1(84.71,58.42)
  Bottom Layer w0.254: v1(77.86,59.94) 77.22,59.94 75.18,61.98 U22.15 ; v1(84.71,58.42) 86.81,60.52 U17.30
ETH_RXD0: length 8.4
  Bottom Layer w0.254: R132.2 84.33,65.52 84.33,64.26 87.08,61.52 U17.32
ETH_RXD1: length 9.3
  Bottom Layer w0.254: U17.33 87.21,62.02 84.81,64.41 84.81,66.57 R133.2
ETH_TXD0: length 28
  Top Layer w0.254: v1(90.43,69.47) 90.43,66.04 v1(85.09,60.71)
  Bottom Layer w0.254: U22.17 74.18,61.46 76.97,58.67 83.06,58.67 v1(85.09,60.71) ; U17.51 90.4,69.5 v1(90.43,69.47)
ETH_TXD1: length 29.9
  Top Layer w0.254: v1(91.06,68.83) 91.06,65.79 v1(85.98,60.71)
  Bottom Layer w0.254: U22.18 73.68,61.19 76.71,58.17 83.44,58.17 v1(85.98,60.71) ; U17.52 90.9,71.03 91.06,70.87 v1(91.06,68.83)
ETH_TXEN: length 24.6
  Top Layer w0.254: v1(82.43,59.44) 82.43,66.29 84.33,68.2 v1(86.75,68.2)
  Bottom Layer w0.254: v1(82.43,59.44) 82.17,59.18 77.21,59.18 74.68,61.71 U22.16 ; v1(86.75,68.2) 87.56,69.02 U17.47
FS: length 220.8
  Top Layer w0.254: v1(89.16,2.41) 87.63,0.89 v1(78.49,0.89) ; v1(89.54,26.67) v1(54.87,26.67) 35.69,26.67 v1(29.59,32.77) ; v1(101.48,58.42) 102.37,57.53 v1(103.76,57.53) ; v1(29.47,6.35) v1(29.47,20.07)
  Bottom Layer w0.254: U16.10 110,58.69 108.84,57.53 v1(103.76,57.53) ; U12.23 29.58,32.78 v1(29.59,32.77) 29.47,32.64 v1(29.47,20.07) ; U13.23 89.58,26.71 v1(89.54,26.67) 97.15,26.67 101.73,31.25 101.73,37.85 99.45,40.13 99.45,46.23 101.4,48.18 U17.3 101.4,58.34 v1(101.48,58.42) ; v1(29.47,6.35) 29,5.88 U14.23 29,3.13 30.87,1.27 78.11,1.27 v1(78.49,0.89) ; NOREF.2 56.52,25.02 v1(54.87,26.67) ; v1(89.16,2.41) 89.2,2.45 U15.23
GLED: length 12.7
  Top Layer w0.254: v1(71.83,68.33) 71.83,69.16 76.33,73.66 v1(76.33,74.21)
  Bottom Layer w0.254: U22.2 74.18,67.41 73.89,67.71 72.25,67.71 71.83,68.12 v1(71.83,68.33)
  Bottom Layer w0.635: LED1.2 v1(76.33,74.21) 76.33,75.69
LED3: length 2.2
  Bottom Layer w0.254: R149.2 91.4,73.59 U17.53
LED4: length 2.4
  Bottom Layer w0.254: U17.54 91.9,73.61 92.21,73.91 92.21,74.3
SCLS: length 302.1
  Top Layer w0.254: v1(115.32,57.79) 111,53.47 111,50.67 113.76,47.92 113.76,37.3 110.37,33.91 103.26,33.91 100.56,36.6 93.45,36.6 92.82,37.23 92.82,38.23 ; v1(93.48,12.7) 92.51,12.7 92.26,12.45 92.26,5.89 91.55,5.18 78.34,5.18 77.33,4.17 40.16,4.17 36.85,7.47 33.55,7.47 32.62,8.4 32.62,10.9 v1(33.53,11.81) 33.48,11.86 33.48,20.37 29.82,24.02 29.82,28.34 27.71,30.45 21.75,30.45 20.96,31.24 20.96,36.7 21.75,37.49 31.65,37.49 33.25,39.1 33.25,41.88 v1(34.27,42.9) 34.3,42.93 37.85,42.93 43.18,37.59 83.32,37.59 83.95,38.23 92.82,38.23 ; v1(96.52,59.69) 94.74,59.69 91.19,56.14 v1(91.19,55.12) ; 92.82,38.23 93.73,38.23 v1(94.36,37.59)
  Bottom Layer w0.254: v1(91.19,55.12) 91.19,51.56 91.93,50.82 91.93,48.15 92.73,47.35 95.66,47.35 97.51,45.49 97.51,39.09 96.02,37.59 v1(94.36,37.59) 93.48,36.71 U13.12 ; v1(96.52,59.69) 98.4,61.56 U17.67 ; 115.57,57.79 v1(115.32,57.79) 114.58,58.52 114.58,64.62 114.36,64.84 113.1,64.84 112.4,64.14 111.76,64.14 111.51,64.39 111.51,65.35 U16.4 ; U15.12 93.1,11.18 93.48,11.56 v1(93.48,12.7) ; v1(33.53,11.81) 32.9,11.18 U14.12 ; v1(34.27,42.9) 34.21,42.9 33.48,42.16 U12.12
SDAS: length 300.9
  Top Layer w0.254: v1(96.52,60.83) 95.38,60.83 90.43,55.88 v1(90.43,55.12) ; 94.99,36.96 94.99,37.99 94.36,38.61 83.83,38.61 83.17,37.95 43.33,37.95 37.8,43.48 33.96,43.48 v1(33.41,42.93) 32.9,42.42 32.9,39.24 31.5,37.85 21.6,37.85 20.6,36.85 20.6,31.09 21.6,30.1 27.56,30.1 29.47,28.19 29.47,23.88 32.9,20.45 v1(32.9,12.32) 32.26,11.68 32.26,8.25 33.41,7.11 36.71,7.11 40.01,3.81 77.47,3.81 78.49,4.83 91.7,4.83 92.84,5.97 v1(92.84,12.06) ; 94.99,36.96 94.11,36.96 v1(93.48,37.59) ; 94.99,36.96 100.71,36.96 103.4,34.26 110.22,34.26 113.4,37.45 113.4,47.77 110.65,50.53 110.65,54.47 v1(115.36,59.18)
  Bottom Layer w0.254: v1(92.84,12.06) 92.45,11.67 U15.11 ; U16.5 114.86,65.36 115.31,64.91 115.31,59.44 115.57,59.18 ; v1(90.43,55.12) 90.43,51.82 91.57,50.67 91.57,48.01 92.59,46.99 95.51,46.99 97.16,45.34 97.16,39.24 96.1,38.18 94.07,38.18 v1(93.48,37.59) 92.83,36.95 U13.11 ; v1(33.41,42.93) 33.34,42.93 32.83,42.42 U12.11 ; U17.66 97.9,62.21 v1(96.52,60.83) ; v1(32.9,12.32) 32.9,12.06 32.25,11.42 U14.11
SWCLK: length 11.8
  Bottom Layer w0.254: 110.61,73.41 110.98,73.05 110.98,72.33 ; 110.61,73.41 SW1.3 ; 110.61,73.41 104.28,73.41 103.95,73.08 U17.76
SWDIO: length 21.9
  Top Layer w0.254: SW1.4 111.48,76.33 100.08,76.33 99.57,75.82 v1(99.57,74.8)
  Bottom Layer w0.254: v1(99.57,74.8) 99.57,73.66 99.83,73.41 100.48,73.41 100.9,72.99 U17.72 ; SW1.4 112.27,73.76 112.27,72.33
TR_1/2MID: length 4.6
  Bottom Layer w0.635: v1(58.55,67.31) v1(57.6,67.31) 56.83,66.55 POE_MODULE1.1
TR_3/6MID: length 10.6
  Top Layer w0.635: POE_MODULE1.2 51.69,63.37 54.11,60.96 L3.15
XTAL1: length 8.3
  Bottom Layer w0.254: 72.46,73.66 72.64,73.66 75.44,70.86 75.44,68.86 75.43,68.85 75.68,68.59 U22.5
XTAL2: length 6.6
  Bottom Layer w0.254: C219.2 71.63,70.77 72.81,69.59 72.81,69.23 73.46,68.58 74.43,68.58 75.18,67.82 U22.4
YLED: length 8.9
  Top Layer w0.254: v1(76.29,72.52) 72.65,68.87 v1(72.65,68.29)
  Bottom Layer w0.254: v1(72.65,68.29) 72.74,68.2 74.17,68.2 74.68,67.69 U22.3
$1N3366: length 3.5
  Bottom Layer w0.762: 28,54.28 R101.2 26.3,52.55 C120.2
$1N3367: length 10.2
  Top Layer w0.762: XLR9.2 23.77,48.61 C120.1
$1N3368: length 17.6
  Top Layer w0.762: XLR9.3 11.18,40.39 8.64,42.93 8.64,52.53 C118.1
$1N3369: length 18.4
  Top Layer w0.762: 45.55,40.39 50.76,40.39 53.14,42.78 53.14,52.54 C123.1
$1N3370: length 15.4
  Top Layer w0.762: C121.1 45.74,44.2 49.36,44.2
$1N3387: length 11
  Bottom Layer w0.254: U12.6 29.58,42.91 29.83,43.16 29.83,49.21 R101.1
$1N3395: length 3.7
  Bottom Layer w0.762: 33.09,52.56 R102.2 ; 33.09,52.56 33.09,54.41 C122.1 ; 33.09,52.56 C121.2
$1N3400: length 3.1
  Bottom Layer w0.254: U12.10 32.19,40.89 C133.2
$1N3402: length 3.1
  Bottom Layer w0.254: C130.2 28.93,43.95 U12.5
$1N3404: length 3.4
  Bottom Layer w0.254: U12.4 28.28,43.08 C134.2
$1N3405: length 3.4
  Bottom Layer w0.254: C134.1 26.98,42.98 U12.2
$1N3410: length 7.2
  Bottom Layer w0.254: C136.2 26.78,32.41 27.62,33.26 27.62,35.27 U12.26
$1N3411: length 2
  Bottom Layer w0.762: C123.2 55.63,52.53 R103.2
$1N3412: length 2
  Bottom Layer w0.762: C118.2 6.23,52.51 R104.2
$1N3413: length 11.3
  Bottom Layer w0.254: R102.1 31.17,49.14 31.17,43.42 30.23,42.47 U12.7
$3N1313: length 3.7
  Bottom Layer w0.762: C145.2 91.38,43.74 R100.2 93.11,43.68 C131.2
$3N1314: length 16
  Top Layer w0.762: 109.36,44.2 105.17,44.2 102.24,41.28 98.03,41.28 C131.1
$3N1315: length 18.8
  Bottom Layer w0.762: 105.16,40.57 110.05,40.57 113.16,43.69 113.16,53.19 C125.1
$3N1316: length 15
  Top Layer w0.762: XLR11.3 75.55,45.72 C139.1
$3N1317: length 10.2
  Top Layer w0.762: C137.1 83.84,48.68 XLR11.2
$3N1341: length 3.7
  Bottom Layer w0.762: C137.2 88.13,52.58 ; 88.13,52.58 R105.2 ; 88.13,52.58 88.13,54.43 C138.1
$3N1346: length 2
  Bottom Layer w0.254: U13.10 92.18,37.63 92.21,37.65
$3N1348: length 3
  Bottom Layer w0.254: U13.5 88.93,38.64 C144.2
$3N1350: length 3.3
  Bottom Layer w0.254: C147.2 88.28,37.77 U13.4
$3N1351: length 3.3
  Bottom Layer w0.254: 86.05,38.61 86.98,37.67 U13.2
$3N1356: length 7.1
  Bottom Layer w0.254: U13.26 87.63,30.09 87.63,28.19 86.66,27.22 C148.2 C149.2
$3N1357: length 2
  Bottom Layer w0.762: C139.2 66.19,50.56 R106.2
$3N1358: length 1.8
  Bottom Layer w0.762: C125.2 115.7,53.19 R107.2
$3N1404: length 6.9
  Bottom Layer w0.254: U13.7 90.23,37.27 91.32,38.35 R100.1
$3N1417: length 16.2
  Bottom Layer w0.254: U13.6 89.58,37.76 89.92,38.1 89.92,49.28 R105.1
$6N1327: length 3.7
  Bottom Layer w0.762: R108.2 34.68,24.44 C162.2
$6N1328: length 15.6
  Top Layer w0.762: XLR14.2 40.96,22.61 C153.1
$6N1329: length 17.9
  Top Layer w0.762: XLR14.3 49.89,10.39 53.09,13.59 53.09,22.59 C152.1
$6N1330: length 17.8
  Top Layer w0.762: XLR13.3 10.95,10.39 8.64,12.7 8.64,22.59 C156.1
$6N1331: length 10.2
  Top Layer w0.762: XLR13.2 23.77,18.61 C154.1
$6N1356: length 3.7
  Bottom Layer w0.762: R109.2 26.29,24.45 C155.1
$6N1360: length 3.9
  Bottom Layer w0.254: U14.10 31.6,11.53 32.14,12.06 32.14,13.52 31.88,13.78
$6N1362: length 3.1
  Bottom Layer w0.254: U14.5 28.35,13.24 C161.2
$6N1364: length 3.4
  Bottom Layer w0.254: C164.2 27.7,12.37 U14.4
$6N1365: length 3.4
  Bottom Layer w0.254: C164.1 26.4,12.27 U14.2
$6N1370: length 7.2
  Bottom Layer w0.254: U14.26 27.06,4.56 27.06,2.54 26.21,1.7 22.25,1.7
$6N1371: length 2
  Bottom Layer w0.762: C156.2 6.1,22.59 R110.2
$6N1372: length 1.8
  Bottom Layer w0.762: C152.2 55.61,22.6 55.61,20.82
$6N1424: length 10.5
  Bottom Layer w0.254: R109.1 29.34,16.26 29.34,12.06 29,11.72 U14.6
$6N1431: length 11.7
  Bottom Layer w0.254: 29.65,10.17 29.65,11.36 30.61,12.32 30.61,16.06 33.86,19.31 R108.1
$10N1313: length 3.6
  Bottom Layer w0.762: 94.68,24.51 94.75,24.45 R112.2
$10N1314: length 15.6
  Top Layer w0.762: XLR16.2 100.96,22.61 C170.1
$10N1315: length 18.7
  Top Layer w0.762: XLR16.3 111.23,10.39 113.16,12.32 113.16,22.59 C169.1
$10N1316: length 15.1
  Top Layer w0.762: XLR15.3 75.55,15.67 C173.1
$10N1317: length 10.3
  Top Layer w0.762: XLR15.2 83.84,18.68 C171.1
$10N1340: length 11.9
  Bottom Layer w0.254: R112.1 93.74,19.44 90.81,16.51 90.81,12.32 89.85,11.36 U15.7
$10N1341: length 3.6
  Bottom Layer w0.762: R113.2 86.36,24.45 C172.1
$10N1345: length 3.1
  Bottom Layer w0.254: U15.10 91.8,13.17 91.76,13.21
$10N1347: length 3.1
  Bottom Layer w0.254: C178.2 88.55,13.24 U15.5
$10N1349: length 3.5
  Bottom Layer w0.254: C181.2 87.9,12.5 87.9,10.17
$10N1350: length 3.6
  Bottom Layer w0.254: C181.1 86.6,12.4 U15.2
$10N1355: length 7.2
  Bottom Layer w0.254: U15.26 87.25,4.56 87.25,2.54 86.46,1.75 C182.2 C183.2
$10N1356: length 1.8
  Bottom Layer w0.762: R114.2 66.04,22.57 C173.2
$10N1357: length 1.8
  Bottom Layer w0.762: C169.2 115.7,22.59 R115.2
$10N1448: length 10.7
  Bottom Layer w0.254: U15.6 89.2,11.72 89.54,12.06 89.54,16.26 R113.1
$15N1912: length 6
  Top Layer w0.254: L3.9 58.09,69.9 59.19,70.99 59.19,74.16 59.17,74.17
$15N1913: length 9.3
  Top Layer w0.254: L3.11 57.11,66.04 56.65,66.51 56.65,74.14 56.67,74.17
$15N1916: length 14.2
  Top Layer w0.254: 54.17,74.17 54.17,71.43 55.88,69.72 55.88,63.37 57.03,62.23 L3.14
$15N1917: length 23
  Top Layer w0.254: 58.09,59.69 51.57,59.69 47.88,63.37 47.88,70.23 46.67,71.44 46.67,74.17
$15N1918: length 16.2
  Top Layer w0.254: 68.46,61.74 68.46,60.2 67.95,59.69 v1(66.89,59.69) ; 68.46,61.74 v1(68.46,64.14) ; 68.46,61.74 69.08,62.36 71.76,62.36 72.14,61.98 U25.2
  Bottom Layer w0.254: v1(68.46,64.14) 68.97,64.65 U22.21
$15N1919: length 18.9
  Top Layer w0.254: L3.3 64.9,62.23 64.27,61.6 64.27,59.06 66.35,56.97 U24.2
  Bottom Layer w0.254: v1(66.81,62.23) 67.82,62.23 69.74,64.15 U22.20
$15N1920: length 17.1
  Top Layer w0.254: v1(66.89,68.58) 67.82,68.58 69.73,70.49 70.62,70.49 71.25,69.85 71.25,68.02 72.17,67.11 72.27,67.11
  Bottom Layer w0.254: U22.22 69.22,65.15 68.08,66.29 68.08,67.95 67.44,68.58 66.93,68.58
$15N1922: length 8.6
  Top Layer w0.254: 69.98,63.71 69.84,63.85 69.84,65.9 v1(69.85,65.91) 68.41,65.91 68.29,66.04 v1(66.89,66.04)
  Bottom Layer w0.254: v1(69.85,65.91) 70.12,65.65 U22.23
$15N1927: length 2.6
  Bottom Layer w0.254: R131.1 71.63,66.8 72.29,66.15 U22.24
$15N1929: length 35.5
  Top Layer w0.635: L3.2 v1(65.41,60.96)
  Top Layer w0.762: v1(65.41,67.31) L3.7 67.82,67.31 v1(70.23,69.72)
  Bottom Layer w0.254: U22.1 73.68,67.04 73.41,67.31 71.51,67.31 70.62,68.2 ; C214.2 71.7,63.06 72.29,63.65 U22.19
  Bottom Layer w0.508: v1(65.41,60.96) 67.82,60.96 69.92,63.06 C214.2
  Bottom Layer w0.635: 69.12,74.34 L4.1 69.12,70.84 v1(70.23,69.72) 70.62,69.34 70.62,68.2
  Bottom Layer w0.762: R129.2 65.41,68.57 v1(65.41,67.31) R130.2 65.41,62.24 R127.2 65.41,62.22 v1(65.41,60.96) 65.41,59.7 R128.2
$15N1934: length 2.4
  Bottom Layer w0.254: R134.1 78.37,64.64 76.85,64.64 U22.10
$15N1936: length 6.3
  Bottom Layer w0.254: R133.1 81.09,68.78 79.72,68.78 R136.1 77.08,66.15 U22.7
$15N1937: length 6
  Bottom Layer w0.254: R132.1 81.04,67.31 79.76,67.31 79.01,66.56 R137.1 78.36,66.55 77.47,65.66 76.85,65.66 U22.8
$15N1948: length 3.8
  Bottom Layer w0.254: 76.18,67.19 76.18,69.56 76.15,69.59
  Bottom Layer w0.635: C216.2 C220.2
$15N1949: length 8.2
  Bottom Layer w0.254: U22.14 75.7,62.98 75.7,62.22 77.34,60.58 78.74,60.58 78.99,60.33 79.7,61.04 81.08,61.04 81.67,60.44 R139.2
$15N1957: length 5.7
  Bottom Layer w0.254: R141.2 81.09,64.47 79.72,64.47 R140.1 78.63,64.14 76.85,64.14 U22.11
